# Altium schematic sheet LED_KEYBOARD.SchDoc
size A4
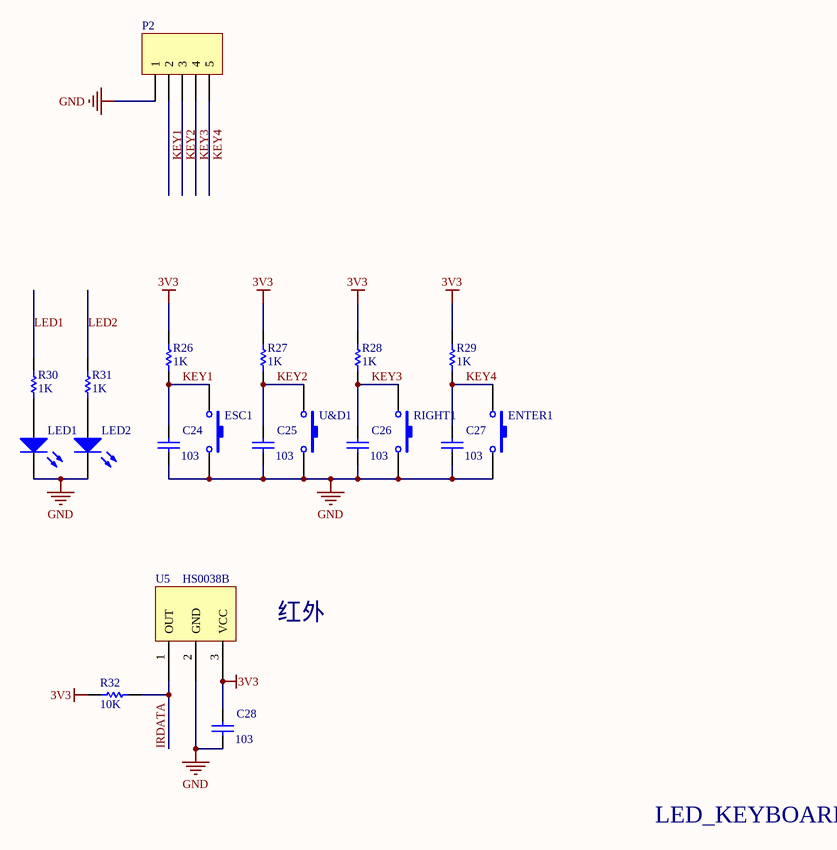
[diagram p0: LED_KEYBOARD.SchDoc]

## Parts
C24  value 103  [RC0805]  (hidden comment: Cap)
C25  value 103  [RC0805]  (hidden comment: Cap)
C26  value 103  [RC0805]  (hidden comment: Cap)
C27  value 103  [RC0805]  (hidden comment: Cap)
C28  value 103  [RC0805]  (hidden comment: Cap)
ENTER1  SW-PB  [小按键]  (value not drawn)
ESC1  SW-PB  [小按键]  (value not drawn)
LED1  LED0  [LED-0805]  (value not drawn)
LED2  LED0  [LED-0805]  (value not drawn)
P2  Header 5  [HDR1X5]  (value not drawn)
R26  value 1K  [RC0805]  (hidden comment: Res1)
R27  value 1K  [RC0805]  (hidden comment: Res1)
R28  value 1K  [RC0805]  (hidden comment: Res1)
R29  value 1K  [RC0805]  (hidden comment: Res1)
R30  value 1K  [RC0805]  (hidden comment: Res1)
R31  value 1K  [RC0805]  (hidden comment: Res1)
R32  value 10K  [RC0805]  (hidden comment: Res1)
RIGHT1  SW-PB  [小按键]  (value not drawn)
U5  HS0038B  [HS0038]
U&D1  SW-PB  [小按键]  (value not drawn)

## Nets
3V3: C28.2 R26.1 R27.1 R28.1 R29.1 R32.1 U5.3(VCC)
GND: C24.1 C25.1 C26.1 C27.1 C28.1 ENTER1.2 ESC1.2 LED1.2(K) LED2.2(K) P2.1 RIGHT1.2 U5.2(GND) U&D1.2
IRDATA: R32.2 U5.1(OUT)
KEY1: C24.2 ESC1.1 P2.2 R26.2
KEY2: C25.2 P2.3 R27.2 U&D1.1
KEY3: C26.2 P2.4 R28.2 RIGHT1.1
KEY4: C27.2 ENTER1.1 P2.5 R29.2
LED1: R30.2
LED2: R31.2
NetLED1_1: LED1.1(A) R30.1
NetLED2_1: LED2.1(A) R31.1

## Notes on the sheet
- 红外
- LED_KEYBOARD

## Library data of the parts
C24-C28 = Cap: Capacitor; Published: 8-Jun-2000; LatestRevisionDate: 17-Jul-2002; LatestRevisionNote: Re-released for DXP Platform.; PackageReference: RAD-0.3; Publisher: Altium Limited; PackageDescription: Radial Cap, Thru-Hole; 2 Leads; 0.3 in Pin Spacing
ENTER1 ESC1 RIGHT1 U&D1 = SW-PB: Switch; Published: 24-Mar-1999; LatestRevisionDate: 17-Jul-2002; LatestRevisionNote: Re-released for DXP Platform.; PackageReference: SPST-2; Publisher: Altium Limited; PackageDescription: Switch; 2 Leads
LED1 LED2 = LED0: Typical INFRARED GaAs LED; Published: 8-Jun-2000; LatestRevisionDate: 08-Jul-2005; LatestRevisionNote: Mech Layer 1 removed.; PackageReference: LED-0; Publisher: Altium Limited; PackageDescription: LED; 2 Leads
P2 = Header 5: Header, 5-Pin; LatestRevisionDate: 17-Jul-2002; LatestRevisionNote: Re-released for DXP Platform.; Publisher: Altium Limited
R26-R32 = Res1: Resistor; Published: 8-Jun-2000; LatestRevisionDate: 17-Jul-2002; LatestRevisionNote: Re-released for DXP Platform.; PackageReference: AXIAL-0.3; Publisher: Altium Limited; PackageDescription: Axial Device, Thru-Hole; 2 Leads; 0.3 in Pin Spacing